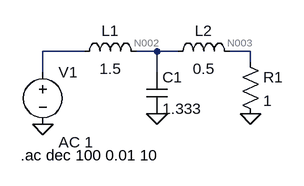
[diagram p0: schematic 1-b.asc]
1-b.asc, the LTspice schematic file:
Version 4
SHEET 1 880 680
WIRE 64 112 0 112
WIRE 176 112 144 112
WIRE 208 112 176 112
WIRE 320 112 288 112
WIRE 320 128 320 112
WIRE 0 144 0 112
WIRE 176 144 176 112
FLAG 0 224 0
FLAG 176 208 0
FLAG 320 208 0
SYMBOL ind 48 128 R270
WINDOW 0 32 56 VTop 2
WINDOW 3 5 56 VBottom 2
SYMATTR InstName L1
SYMATTR Value 1.5
SYMBOL cap 160 144 R0
SYMATTR InstName C1
SYMATTR Value 1.333
SYMBOL ind 192 128 R270
WINDOW 0 32 56 VTop 2
WINDOW 3 5 56 VBottom 2
SYMATTR InstName L2
SYMATTR Value 0.5
SYMBOL res 304 112 R0
SYMATTR InstName R1
SYMATTR Value 1
SYMBOL voltage 0 128 R0
WINDOW 123 24 124 Left 2
WINDOW 39 0 0 Left 0
SYMATTR InstName V1
SYMATTR Value ""
SYMATTR Value2 AC 1
TEXT -34 272 Left 2 !.ac dec 100 0.01 10

The netlist it stands for:
* 1-b.asc
L1 N001 N002 1.5
C1 N002 0 1.333
L2 N002 N003 0.5
R1 N003 0 1
V1 N001 0 AC 1
.ac dec 100 0.01 10
.backanno
.end

* Results of the author's LTspice run, read from the files saved beside the schematic
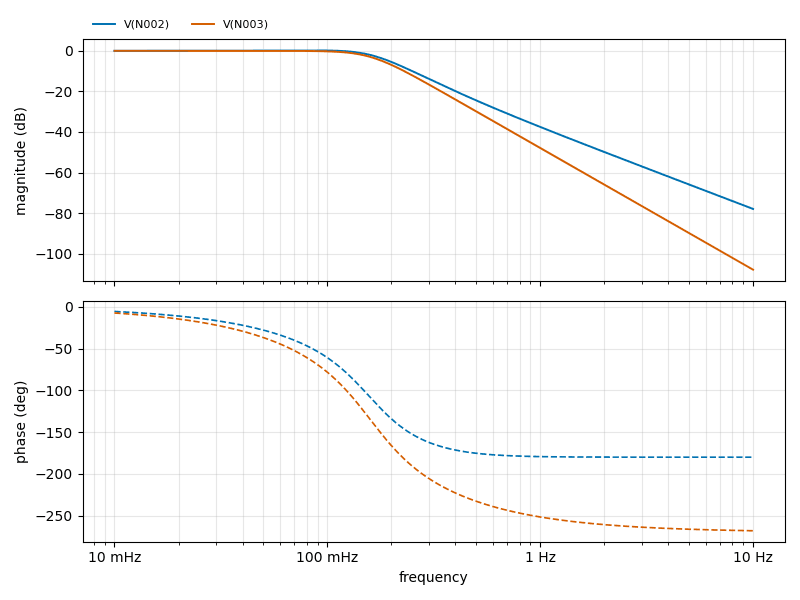
[diagram p1: AC Analysis of 1-b.asc, plotted from the saved traces]
* AC Analysis, 1 run:
*   V(N002): -0.00 dB at 10 mHz, -77.94 dB at 10 Hz, peak 0.20 dB at 85.11 mHz, 3 dB below the peak at 169.3 mHz
*   V(N003): -0.02 dB at 10 mHz, -107.89 dB at 10 Hz, peak -0.02 dB at 33.88 mHz, 3 dB below the peak at 159.2 mHz